# EAGLE design DMX (EAGLE 6.0)
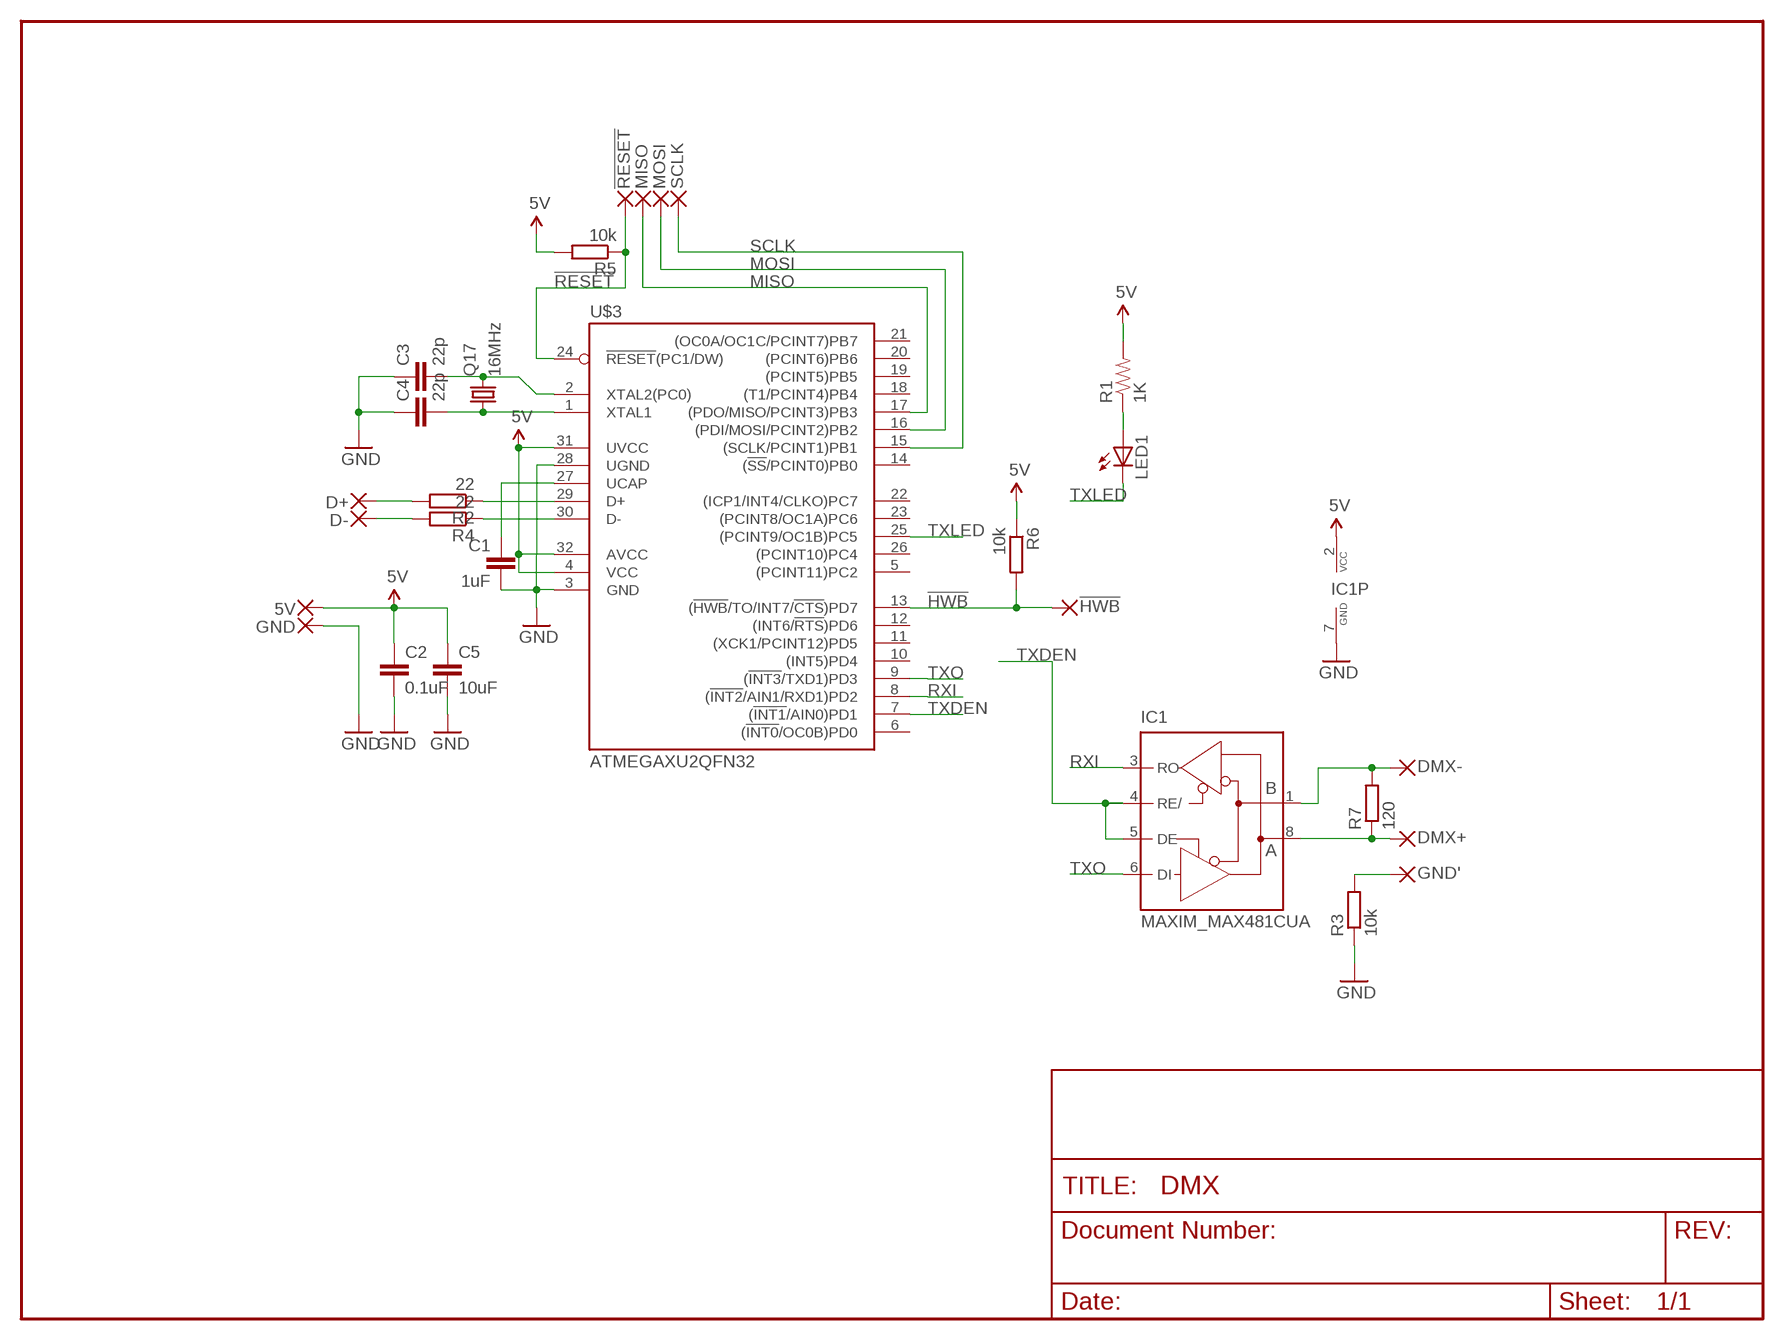
[diagram p0: schematic, sheet 1]

## Parts
5V  WIREPAD2,15/1,0  [2,15/1,0]
!HWB  WIREPADSMDCONTACT  [SMDCONTACT]
!RESET  WIREPADSMDCONTACT  [SMDCONTACT]
C1  1uF  CAP0603-CAP  [0603-CAP]
C2  0.1uF  CAP0603-CAP  [0603-CAP]
C3  22p  C-EUC0603  [C0603]
C4  22p  C-EUC0603  [C0603]
C5  10uF  C-EUC0603K  [C0603K]
D+  WIREPAD2,15/1,0  [2,15/1,0]
D-  WIREPAD2,15/1,0  [2,15/1,0]
DMX+  WIREPADSMD2,54-2,54  [SMD2,54-2,54]
DMX-  WIREPADSMD2,54-2,54  [SMD2,54-2,54]
GND  WIREPAD2,15/1,0  [2,15/1,0]
GND'  WIREPADSMD2,54-2,54  [SMD2,54-2,54]
IC1  MAXIM_MAX481CUA  [MAXIM_UMAX8]
LED1  LEDSML0805  [SML0805]
MISO  WIREPADSMDCONTACT  [SMDCONTACT]
MOSI  WIREPADSMDCONTACT  [SMDCONTACT]
Q17  16MHz  CRYSTAL7M  [TXC-7M]
R1  1K  RESISTOR0603-RES  [0603-RES]
R2  22  R-EU_R0603  [R0603]
R3  10k  R-EU_R0603  [R0603]
R4  22  R-EU_R0603  [R0603]
R5  10k  R-EU_R0603  [R0603]
R6  10k  R-EU_R0603  [R0603]
R7  120  R-EU_R0603  [R0603]
SCLK  WIREPADSMDCONTACT  [SMDCONTACT]
U$3  ATMEGAXU2QFN32  [RHB_S-PQFP-N32]

## Nets
5V: 5V.1(P) C2.1 C5.1 IC1.2(VCC) R1.2 R5.2 R6.1 U$3.4(VCC) U$3.31(UVCC) U$3.32(AVCC)
!HWB: !HWB.1(P) R6.2 U$3.13((!HWB!/TO/INT7/!CTS!)PD7)
!RESET: !RESET.1(P) R5.1 U$3.24(!RESET!(PC1/DW))
DMX+: DMX+.1(P) IC1.8(A) R7.1
DMX-: DMX-.1(P) IC1.1(B) R7.2
GND [power]: C1.2 C2.2 C3.1 C4.1 C5.2 GND.1(P) IC1.7(GND) R3.1 U$3.3(GND) U$3.28(UGND)
GND': GND'.1(P) R3.2
MISO: MISO.1(P) U$3.17((PDO/MISO/PCINT3)PB3)
MOSI: MOSI.1(P) U$3.16((PDI/MOSI/PCINT2)PB2)
N$1: LED1.A R1.1
N$2: C1.1 U$3.27(UCAP)
N$6: D+.1(P) R2.2
N$7: D-.1(P) R4.2
N$8: R2.1 U$3.29(D+)
N$9: R4.1 U$3.30(D-)
N$10: C3.2 Q17.B U$3.2(XTAL2(PC0))
N$11: C4.2 Q17.A U$3.1(XTAL1)
RXI: IC1.3(RO) U$3.8((!INT2!/AIN1/RXD1)PD2)
SCLK: SCLK.1(P) U$3.15((SCLK/PCINT1)PB1)
TXDEN: IC1.4(RE/) IC1.5(DE) U$3.7((!INT1!/AIN0)PD1)
TXLED: LED1.C U$3.25((PCINT9/OC1B)PC5)
TXO: IC1.6(DI) U$3.9((!INT3!/TXD1)PD3)
Unconnected: U$3.5((PCINT11)PC2) U$3.6((!INT0!/OC0B)PD0) U$3.10((INT5)PD4) U$3.11((XCK1/PCINT12)PD5) U$3.12((INT6/!RTS!)PD6) U$3.14((!SS!/PCINT0)PB0) U$3.18((T1/PCINT4)PB4) U$3.19((PCINT5)PB5) U$3.20((PCINT6)PB6) U$3.21((OC0A/OC1C/PCINT7)PB7) U$3.22((ICP1/INT4/CLKO)PC7) U$3.23((PCINT8/OC1A)PC6) U$3.26((PCINT10)PC4)

## Library data of the parts
5V D+ D- GND = wirepad:WIREPAD: Wire PAD connect wire on PCB
!HWB !RESET DMX+ DMX- GND' MISO MOSI SCLK = jocki:WIREPAD: Wire PAD connect wire on PCB
C1 C2 = SparkFun:CAP: Capacitor Standard 0603 ceramic capacitor, and 0.1" leaded capacitor.
C3-C5 = rcl:C-EU: CAPACITOR, European symbol
IC1 = DMX:MAXIM_MAX481CUA: RS485 TRANSEIVER
LED1 = led:LED: LED OSRAM: - CHIPLED LG R971, LG N971, LY N971, LG Q971, LY Q971, LO R971, LY R971 LH N974, LH R974 LS Q976, LO Q976, LY Q976 LO Q996 - Hyper CHIPLED LW Q18S LB Q993, LB Q99A, LB R99A - SideLED LS A670, LO A670, LY A670, LG A670, LP A670 LB A673, LV A673, LT A673, LW A673 LH A674 LY A675 LS A676, LA A676, LO A676, LY A676, LW A676 LS A679, LY A679, LG A679 - Hyper Micro SIDELED® LS Y876, LA Y876, LO Y876, LY Y876 LT Y87S - SmartLED LW L88C, LW L88S LB L89C, LB L89S, LG L890 LS L89K, LO L89K, LY L89K LS L896, LA L896, LO L896, LY L896 - TOPLED LS T670, LO T670, LY T670, LG T670, LP T670 LSG T670, LSP T670, LSY T670, LOP T670, LYG T670 LG T671, LOG T671, LSG T671 LB T673, LV T673, LT T673, LW T673 LH T674 LS T676, LA T676, LO T676, LY T676, LB T676, LH T676, LSB T676, LW T676 LB T67C, LV T67C, LT T67C, LS T67K, LO T67K, LY T67K, LW E67C LS E67B, LA E67B, LO E67B, LY E67B, LB E67C, LV E67C, LT E67C LW T67C LS T679, LY T679, LG T679 LS T770, LO T770, LY T770, LG T770, LP T770 LB T773, LV T773, LT T773, LW T773 LH T774 LS E675, LA E675, LY E675, LS T675 LS T776, LA T776, LO T776, LY T776, LB T776 LHGB T686 LT T68C, LB T68C - Hyper Mini TOPLED® LB M676 - Mini TOPLED Santana® LG M470 LS M47K, LO M47K, LY M47K Source: http://www.osram.convergy.de LUXEON: - LUMILED® LXK2-PW12-R00, LXK2-PW12-S00, LXK2-PW14-U00, LXK2-PW14-V00 LXK2-PM12-R00, LXK2-PM12-S00, LXK2-PM14-U00 LXK2-PE12-Q00, LXK2-PE12-R00, LXK2-PE12-S00, LXK2-PE14-T00, LXK2-PE14-U00 LXK2-PB12-K00, LXK2-PB12-L00, LXK2-PB12-M00, LXK2-PB14-N00, LXK2-PB14-P00, LXK2-PB14-Q00 LXK2-PR12-L00, LXK2-PR12-M00, LXK2-PR14-Q00, LXK2-PR14-R00 LXK2-PD12-Q00, LXK2-PD12-R00, LXK2-PD12-S00 LXK2-PH12-R00, LXK2-PH12-S00 LXK2-PL12-P00, LXK2-PL12-Q00, LXK2-PL12-R00 Source: www.luxeon.com KINGBRIGHT: KA-3528ASYC Source: www.kingbright.com
Q17 = jocki:CRYSTAL
R1 = SparkFun:RESISTOR: Resistor Basic schematic elements and footprints for 0603, 1206, and PTH resistors.
R2-R7 = rcl:R-EU_: RESISTOR, European symbol
U$3 = jocki:ATMEGAXU2

## Net classes
0 default: width 0.203 mm
1 power: width 0.254 mm

## Board
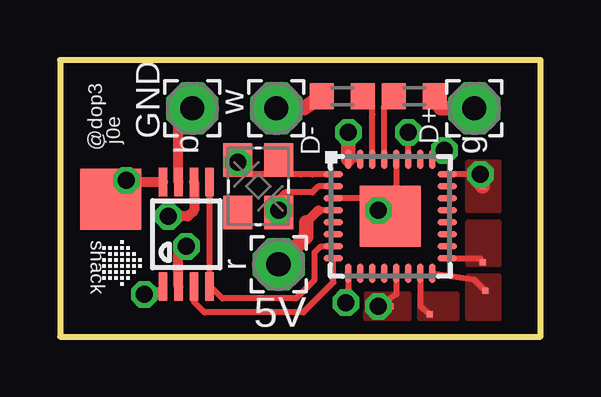
[diagram p1: board, top side]
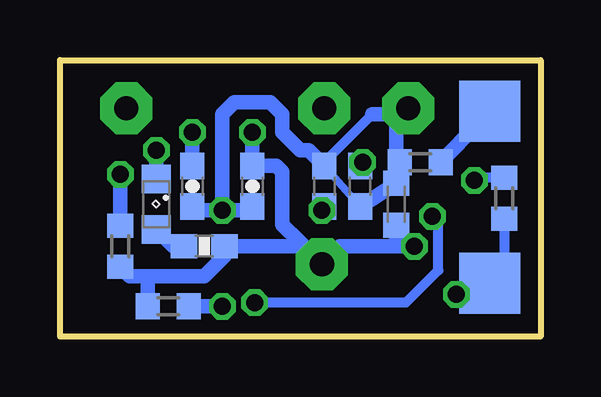
[diagram p2: board, bottom side, seen from below]

Size 20.02 x 11.52 mm. Coordinates in mm from the lower left corner, seen from the top.
Outline: 20.02,0 20.02,11.52 0,11.52 0,0 20.02,0
Copper layers (1*16): Top 0.035mm / dielectric 1.5mm / Bottom 0.035mm
Design rules: minimum track width 8mil, minimum drill 0.6mm, track to track 8mil, track to pad 8mil, pad to pad 8mil, via to via 8mil, smd to smd 0mil, copper to edge 20mil, drill to drill 10mil, minimum pad ring 8mil, minimum via ring 8mil, stop-mask expansion 0mil, vias tented up to drill 0.8mm, thermal gap 10mil

### Footprints (pad centres in the part's own frame; a part is rotated, then mirrored left to right if it is on the bottom)
2,15/1,0 = drill 1.016 pad 2.159 octagon: 1 0,0
SMDCONTACT = smd 0.254 x 0.254: 1 0,0
0603-CAP = smd 1.1 x 1: 1 -0.85,0; 2 0.85,0
C0603 = smd 1.1 x 1: 1 -0.85,0; 2 0.85,0
C0603K = smd 1.05 x 1.08: 1 -0.875,0; 2 0.875,0
SMD2,54-2,54 = smd 2.54 x 2.54: 1 0,0
MAXIM_UMAX8 = smd 0.35 x 1.2: 1 -0.975,-2.175; 2 -0.325,-2.175; 3 0.325,-2.175; 4 0.975,-2.175; 5 0.975,2.175; 6 0.325,2.175; 7 -0.325,2.175; 8 -0.975,2.175
SML0805 = smd 1.2 x 1.2: A 1.05,0; C -1.05,0
TXC-7M = smd 1.4 x 1.2: A -1.1,-0.85; B 1.1,0.85; NC1 -1.1,0.85; NC2 1.1,-0.85
0603-RES = smd 1.1 x 1: 1 -0.85,0; 2 0.85,0
R0603 = smd 1 x 1.1: 1 -0.85,0; 2 0.85,0
RHB_S-PQFP-N32 = smd 0.825 x 0.275: 1 -2.375,1.75; 2 -2.375,1.25; 3 -2.375,0.75; 4 -2.375,0.25; 5 -2.375,-0.25; 6 -2.375,-0.75; 7 -2.375,-1.25; 8 -2.375,-1.75; 17 2.375,-1.75; 18 2.375,-1.25; 19 2.375,-0.75; 20 2.375,-0.25; 21 2.375,0.25; 22 2.375,0.75; 23 2.375,1.25; 24 2.375,1.75 | smd 0.275 x 0.825: 9 -1.75,-2.375; 10 -1.25,-2.375; 11 -0.75,-2.375; 12 -0.25,-2.375; 13 0.25,-2.375; 14 0.75,-2.375; 15 1.25,-2.375; 16 1.75,-2.375; 25 1.75,2.375; 26 1.25,2.375; 27 0.75,2.375; 28 0.25,2.375; 29 -0.25,2.375; 30 -0.75,2.375; 31 -1.25,2.375; 32 -1.75,2.375 | smd 2.54 x 2.54: EXP 0,0

### Placement (x,y rotation side)
5V  9.11,3.01 90 top
!HWB  13.76,1.26 90 top
!RESET  17.61,6.27 90 top
C1  14.51,6.26 270 bottom
C2  12.01,6.26 270 bottom
C3  9.01,6.26 270 bottom
C4  7.51,6.26 90 bottom
C5  6.01,5.51 90 bottom
D+  17.26,9.51 270 top
D-  9.01,9.51 270 top
DMX+  2.11,5.72 90 top
DMX-  2.11,2.22 270 bottom
GND  5.51,9.51 90 top
GND'  2.11,9.38 270 bottom
IC1  5.26,4.26 0 top
LED1  16.01,5.51 270 bottom
MISO  17.61,3.09 90 top
MOSI  17.71,1.91 90 top
Q17  8.26,6.26 270 top
R1  14.01,3.76 0 bottom
R2  14.76,10.01 0 top
R3  5.01,7.26 0 bottom
R4  11.76,10.01 180 top
R5  17.51,3.76 270 bottom
R6  15.51,1.26 0 bottom
R7  1.51,5.76 270 bottom
SCLK  15.41,0.93 90 top
U$3  13.76,5.01 0 top

### Tracks (layer width: path | path; a pad name or v marks a point on that pad's centre or on a via)
5V  (via drill 0.7)
  Top 0.254: U$3.32 U$3.31 | U$3.4 10.76,5.26
  Top 0.406: IC1.2 4.94,3.44 v5.26,3.76 | 10.76,5.26 10.26,4.76
  Top 0.61: U$3.32 v12.01,8.51 | 10.26,4.76 10.26,4.16 5V.1
  Bottom 0.61: v5.26,3.76 6.01,3.76 | 6.01,3.76 8.36,3.76 5V.1 | C5.1 6.01,3.76 | v12.01,8.51 C2.1 11.02,7.11 10.76,6.86 10.76,4.66 10.06,3.96 | 10.06,3.96 5V.1 | 9.36,3.26 5V.1 | 10.06,3.96 10.26,3.76 R1.2 13.16,3.36 13.76,2.76 14.01,2.51 16.26,2.51 | 16.26,2.51 17.11,2.51 R5.2 | R6.1 16.36,2.41 16.26,2.51
!HWB  (via drill 0.7)
  Top 0.254: U$3.13 14.01,1.76 v13.26,1.26 !HWB.1
  Bottom 0.61: R6.2 v13.26,1.26
  pour Top (no thermals): 12.76,0.76 12.76,1.76 14.51,1.76 14.51,0.76
!RESET  (via drill 0.7)
  Top 0.254: v17.51,6.76 17.26,6.76 U$3.24
  Top 0.61: v17.51,6.76 !RESET.1
  Bottom 0.61: R5.1 v17.51,6.76
  pour Top (no thermals): 18.26,5.26 17.01,5.26 17.01,7.26 18.26,7.26
DMX+  (via drill 0.7)
  Top 0.254: DMX+.1 2.83,6.44 2.83,6.45 v2.76,6.51
  Top 0.406: IC1.8 2.83,6.44
  Bottom 0.406: R7.1 2.66,6.61 v2.76,6.51
DMX-  (via drill 0.7)
  Top 0.254: IC1.1 3.96,1.76
  Top 0.406: 3.96,1.76 v3.51,1.76
  Bottom 0.254: 1.51,2.82 DMX-.1
  Bottom 0.406: v3.51,1.76 2.57,1.76 DMX-.1 | R7.2 1.51,2.82
GND  (via drill 0.7)
  Top 0.254: U$3.28 14.01,6.27 13.51,5.76 | 13.51,5.76 U$3.3 | 13.51,5.76 v13.26,5.26
  Top 0.406: IC1.7 4.94,8.94 GND.1
  Bottom 0.305: C4.1 C3.1
  Bottom 0.406: C1.2 14.36,5.26 | C5.2 5.76,7.16 R3.1 | 9.01,7.26 7.01,9.26
  Bottom 0.61: 14.36,5.26 v13.26,5.26 | 6.01,9.26 C5.2 C4.1 | 6.01,9.26 GND.1 | 7.01,9.26 6.01,9.26 | v13.26,5.26 13.26,8.76 13.26,9.26 12.76,9.76 11.76,9.76 11.26,9.76 11.01,9.51 10.76,9.26 10.76,8.51 10.01,7.76 9.66,7.76 C3.1 | C2.2 12.16,5.26 v13.26,5.26
GND'
  Bottom 0.61: R3.2 GND'.1
MISO
  Top 0.254: U$3.17 17.51,3.26 MISO.1
  pour Top (no thermals): 18.26,3.01 17.01,3.01 17.01,4.76 18.26,4.76
MOSI
  Top 0.254: U$3.16 17.24,2.39 MOSI.1
  pour Top (no thermals): 17.01,0.76 17.01,2.51 18.26,2.51 18.26,0.76
N$1
  Bottom 0.61: R1.1 15.31,3.76 LED1.A
N$2  (via drill 0.7)
  Top 0.254: U$3.27 v14.51,8.51
  Bottom 0.61: v14.51,8.51 C1.1
N$6
  Top 0.254: R2.2 15.86,9.51
  Top 0.61: 15.86,9.51 D+.1
N$7
  Top 0.61: R4.2 10.16,9.51 D-.1
N$8
  Top 0.254: U$3.29 13.51,9.51 13.51,9.61 R2.1
N$9
  Top 0.254: U$3.30 13.01,9.26 13.01,9.61 R4.1
N$10  (via drill 0.7)
  Top 0.254: v9.11,5.26 Q17.B 9.11,5.76 9.37,6.01 10.51,6.01 10.76,6.26 U$3.2
  Bottom 0.254: v9.11,5.26 C3.2
N$11  (via drill 0.7)
  Top 0.254: 7.41,7.79 Q17.A v7.41,7.26 8.01,6.76 10.01,6.76 10.51,6.76 U$3.1
  Bottom 0.254: v7.41,7.26 C4.2
RXI
  Top 0.254: IC1.3 5.59,1.44 6.01,1.01 10.14,1.01 11.39,2.26 U$3.8
SCLK
  Top 0.254: U$3.15 15.01,1.51 15.01,1.26 SCLK.1
  pour Top (no thermals): 15.01,0.76 15.01,1.76 16.51,1.76 16.51,0.76
TXDEN
  Top 0.254: IC1.5 IC1.4 6.26,2.09 6.76,1.59 9.84,1.59 10.61,2.36 10.61,3.51 10.87,3.76 U$3.7
TXLED  (via drill 0.7)
  Top 0.254: U$3.25 15.89,7.51 v16.01,7.76
  Bottom 0.61: LED1.C v16.01,7.76
TXO  (via drill 0.7)
  Top 0.254: U$3.9 12.01,1.51 v11.91,1.41
  Top 0.406: IC1.6 5.59,5.27 5.33,5.01 v4.51,5.01
  Bottom 0.406: v4.51,5.01 4.26,4.76 4.26,2.76 5.61,1.41 v11.91,1.41

### Text on the board
tPlace: w | b | g | @dop3 | j0e | shack | r